# Altium schematic sheet PFC_Stage.SchDoc
size A2; Author: Rahul G; DrawnBy: Rahul G; Engineer: Rahul G; DocumentNumber: 1; SheetNumber: 1; SheetTotal: 10
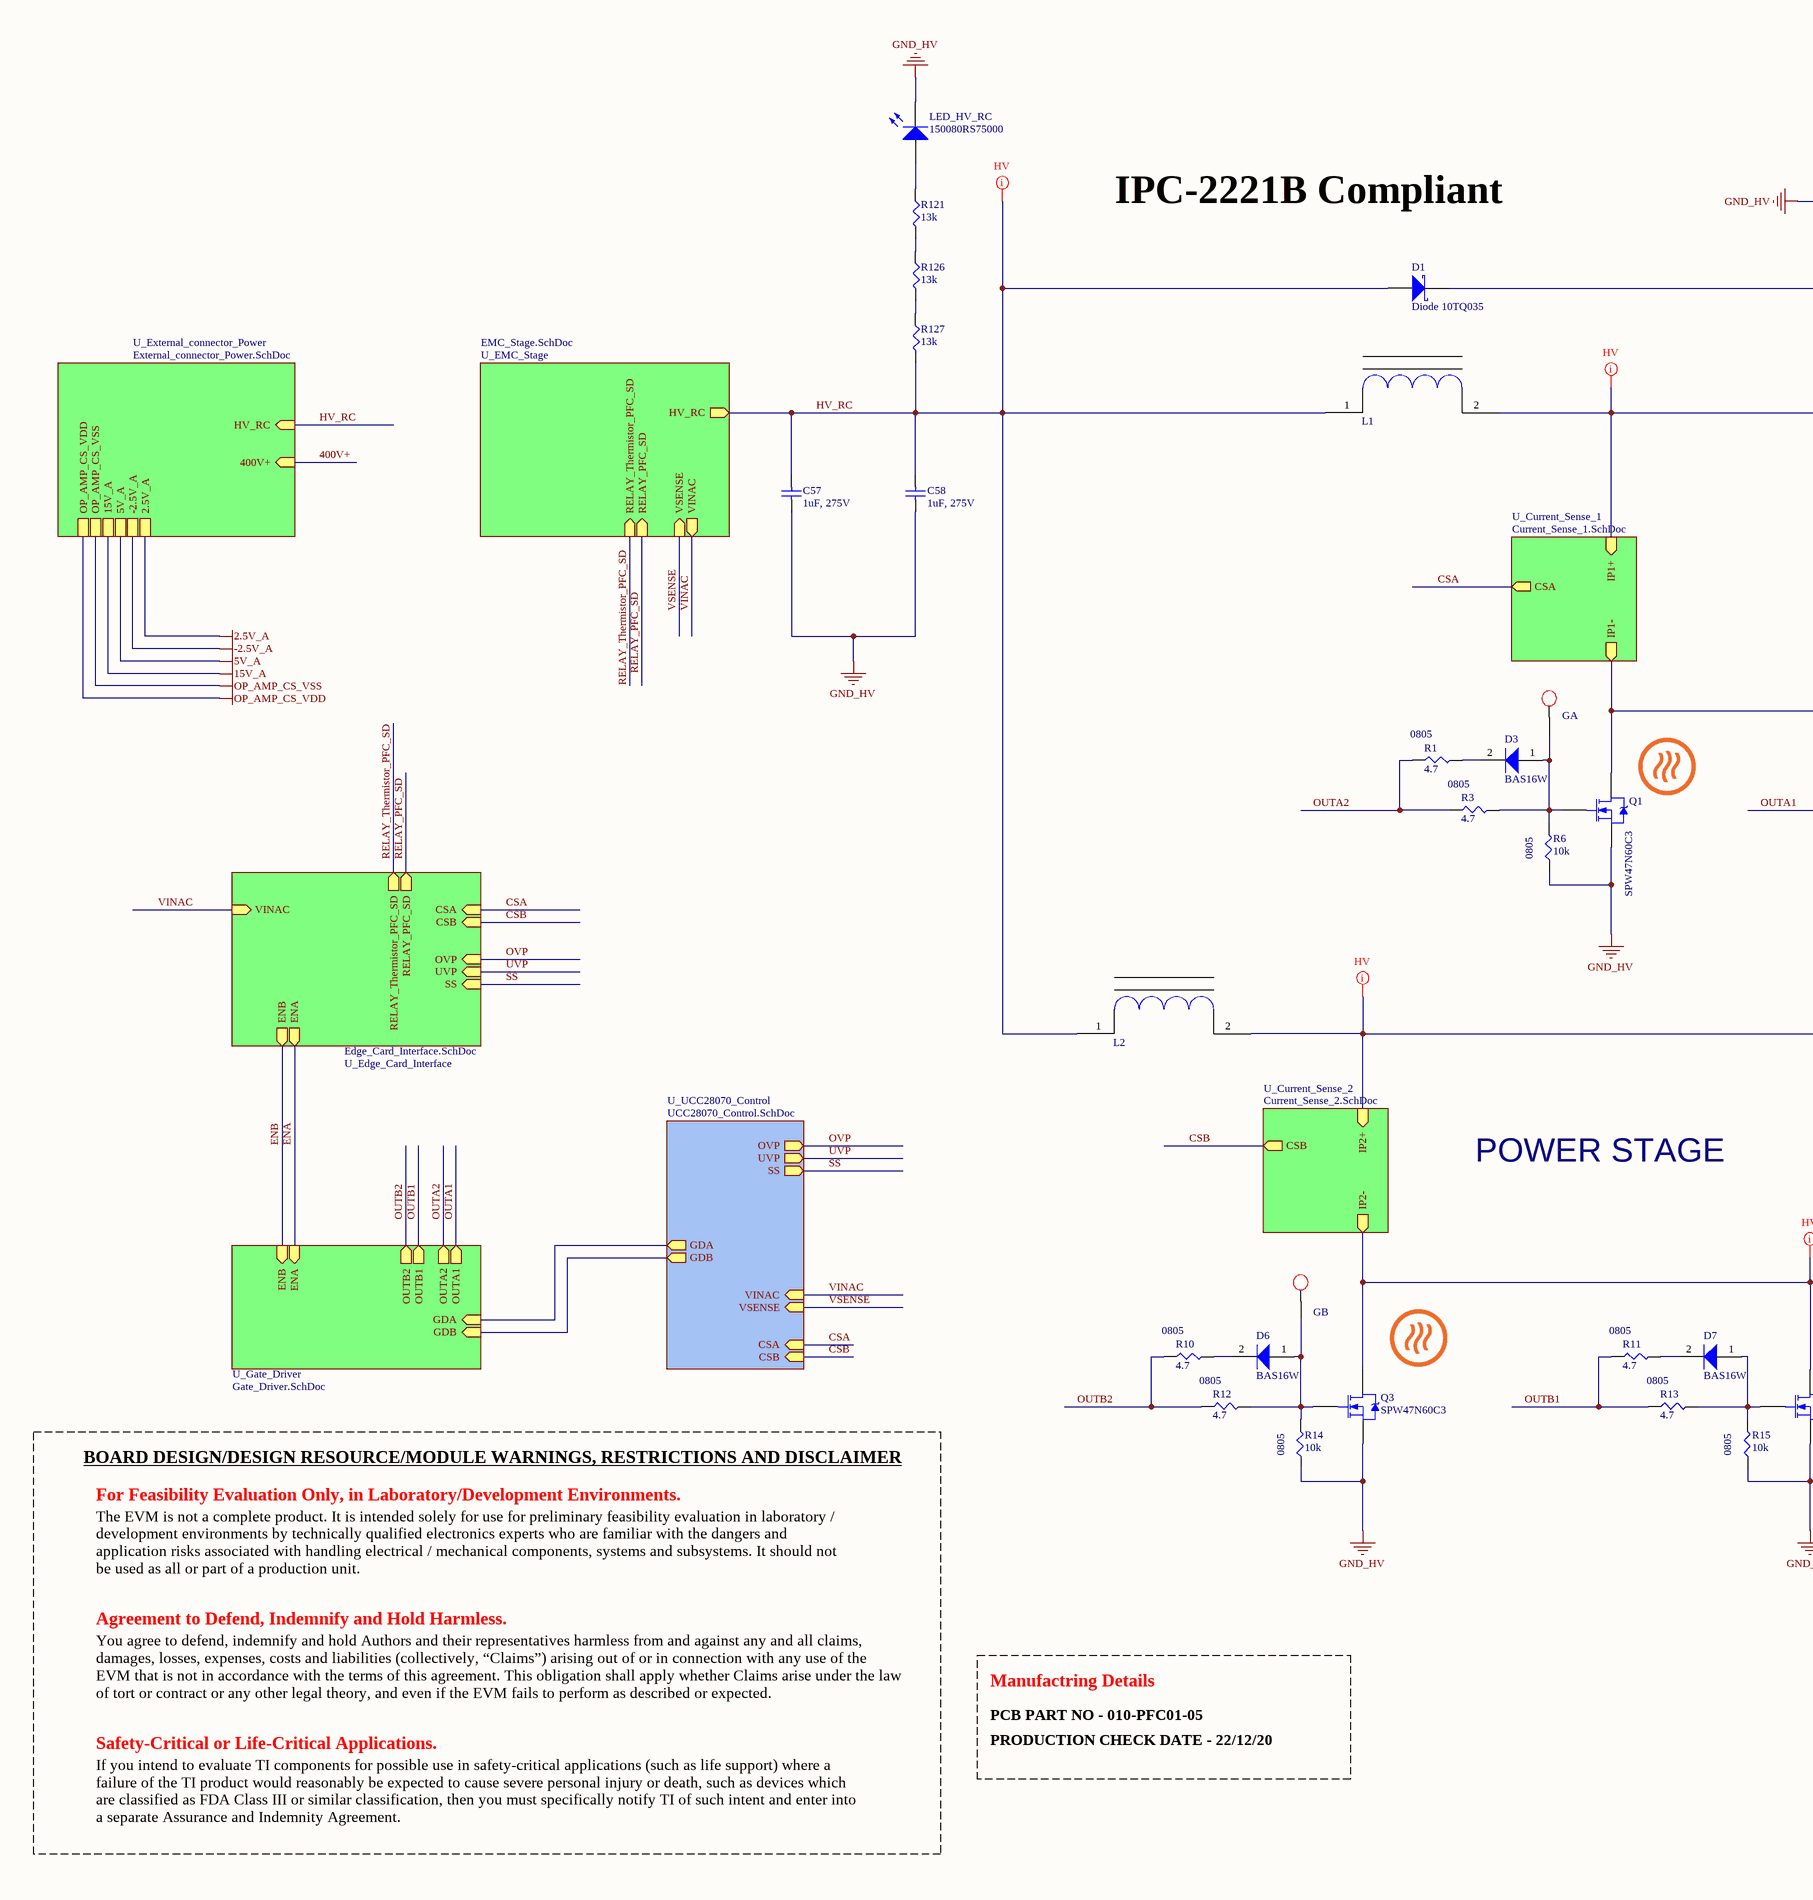
[diagram p0: PFC_Stage.SchDoc, left]
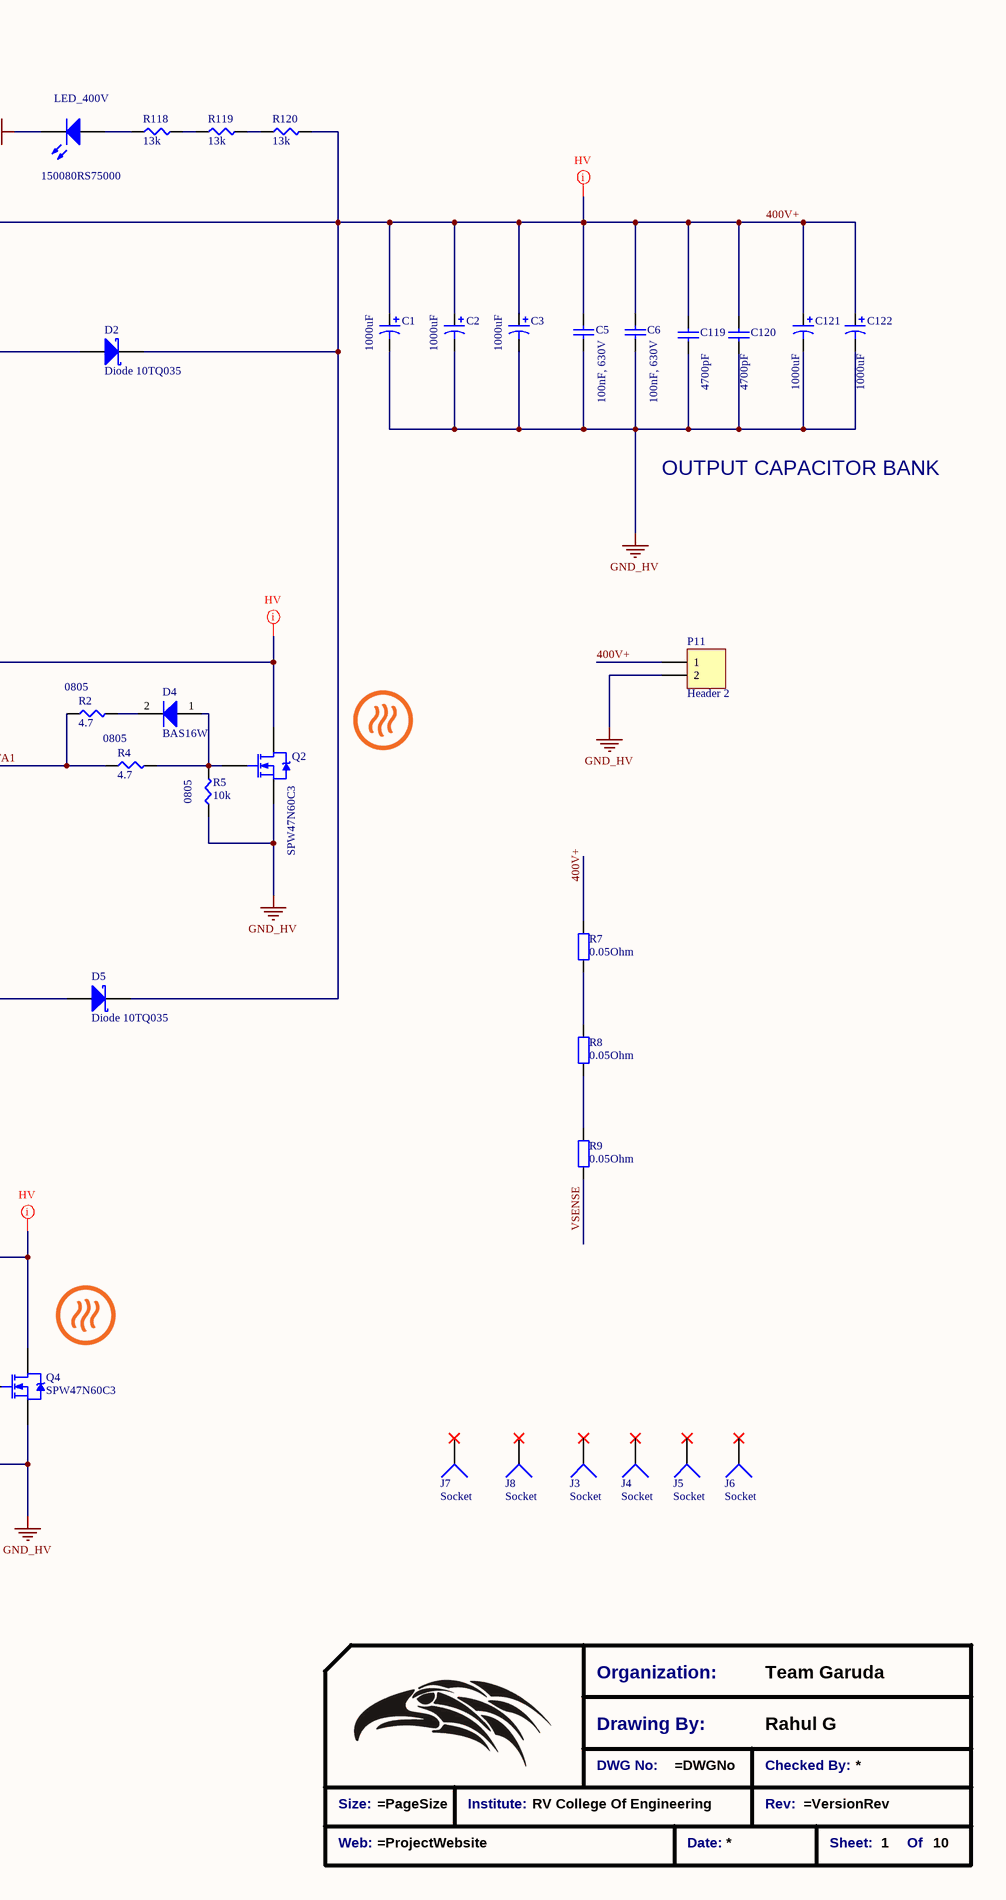
[diagram p1: PFC_Stage.SchDoc, right]

## Parts
*  Title_Block  (value not drawn)  (graphical)
C1  value 1000uF  [450V_40mm_10mm]  (hidden comment: 40mm)
C2  value 1000uF  [450V_40mm_10mm]  (hidden comment: 40mm)
C3  value 1000uF  [450V_40mm_10mm]  (hidden comment: 40mm)
C5  100nF, 630V  [L18_W6_H12_P15]
C6  100nF, 630V  [L18_W6_H12_P15]
C57  1uF, 275V  [L26_W11_H20_P22.5_CS]
C58  1uF, 275V  [L26_W11_H20_P22.5_CS]
C119  value 4700pF  [VY1472M61Y5UC63V0]  (hidden comment: VY1472M61Y5UC63V0)
C120  value 4700pF  [VY1472M61Y5UC63V0]  (hidden comment: VY1472M61Y5UC63V0)
C121  value 1000uF  [450V_40mm_10mm]  (hidden comment: 40mm)
C122  value 1000uF  [450V_40mm_10mm]  (hidden comment: 40mm)
D1  Diode 10TQ035  [INF-PG-TO247-2-MOD]
D2  Diode 10TQ035  [INF-PG-TO247-2-MOD]
D3  BAS16W  [SODFL250X110-2N]
D4  BAS16W  [SODFL250X110-2N]
D5  Diode 10TQ035  [INF-PG-TO247-2-MOD]
D6  BAS16W  [SODFL250X110-2N]
D7  BAS16W  [SODFL250X110-2N]
GA  Test Point  [Test_point_SMD]  (value not drawn)  (no BOM)
GB  Test Point  [Test_point_SMD]  (value not drawn)  (no BOM)
J3  Socket  [Mounting_hole_3mm]
J4  Socket  [Mounting_hole_3mm]
J5  Socket  [Mounting_hole_3mm]
J6  Socket  [Mounting_hole_3mm]
J7  Socket  [Mounting_hole_3mm_no_body]
J8  Socket  [Mounting_hole_3mm_no_body]
L1  Transformer_Inductor  [PFC_Toroid_MPP]  (value not drawn)
L2  Transformer_Inductor  [PFC_Toroid_MPP]  (value not drawn)
LED_400V  150080RS75000  [0805_A]
LED_HV_RC  150080RS75000  [0805_A]
P11  Header 2  [Barrier_Strip_2]
Q1  SPW47N60C3  [INF-PG-TO247-3-44]
Q2  SPW47N60C3  [INF-PG-TO247-3-44]
Q3  SPW47N60C3  [INF-PG-TO247-3-44]
Q4  SPW47N60C3  [INF-PG-TO247-3-44]
R1  4.7  Supplier Device Package: 0805  [SMD-0805-RES]
R2  4.7  Supplier Device Package: 0805  [SMD-0805-RES]
R3  4.7  Supplier Device Package: 0805  [SMD-0805-RES]
R4  4.7  Supplier Device Package: 0805  [SMD-0805-RES]
R5  10k  Supplier Device Package: 0805  [SMD-0805-RES]
R6  10k  Supplier Device Package: 0805  [SMD-0805-RES]
R7  0.05Ohm  [WRIS-KSKE_1206_H=0.6mm]
R8  0.05Ohm  [WRIS-KSKE_1206_H=0.6mm]
R9  0.05Ohm  [WRIS-KSKE_1206_H=0.6mm]
R10  4.7  Supplier Device Package: 0805  [SMD-0805-RES]
R11  4.7  Supplier Device Package: 0805  [SMD-0805-RES]
R12  4.7  Supplier Device Package: 0805  [SMD-0805-RES]
R13  4.7  Supplier Device Package: 0805  [SMD-0805-RES]
R14  10k  Supplier Device Package: 0805  [SMD-0805-RES]
R15  10k  Supplier Device Package: 0805  [SMD-0805-RES]
R118  13k  [SMD-2512-RES]
R119  13k  [SMD-2512-RES]
R120  13k  [SMD-2512-RES]
R121  13k  [SMD-2512-RES]
R126  13k  [SMD-2512-RES]
R127  13k  [SMD-2512-RES]

## Sub-sheets
U_Current_Sense_1 = Current_Sense_1.SchDoc: CSA (out), IP1+ (in), IP1- (out)
U_Current_Sense_2 = Current_Sense_2.SchDoc: CSB (out), IP2+ (in), IP2- (out)
U_Edge_Card_Interface = Edge_Card_Interface.SchDoc: OVP (in), UVP (in), CSA (in), CSB (in), SS (in), RELAY_PFC_SD (out), RELAY_Thermistor_PFC_SD (out), ENB (out), ENA (out), VINAC (in)
U_EMC_Stage = EMC_Stage.SchDoc: RELAY_PFC_SD (in), HV_RC (out), VINAC (out), VSENSE (in), RELAY_Thermistor_PFC_SD (in)
U_External_connector_Power = External_connector_Power.SchDoc: 400V+ (in), OP_AMP_CS_VDD, -2.5V_A, 15V_A, OP_AMP_CS_VSS, 5V_A, 2.5V_A, HV_RC (in)
U_Gate_Driver = Gate_Driver.SchDoc: GDB (in), GDA (in), ENB (in), ENA (in), OUTA2 (out), OUTB2 (out), OUTB1 (out), OUTA1 (out)
U_UCC28070_Control = UCC28070_Control.SchDoc: GDB (out), CSA (in), CSB (in), VINAC (in), GDA (out), VSENSE (in), OVP (out), UVP (out), SS (out)

## Nets
2.5V_A: sheet U_External_connector_Power/2.5V_A
5V_A: sheet U_External_connector_Power/5V_A
15V_A: sheet U_External_connector_Power/15V_A
-2.5V_A: sheet U_External_connector_Power/-2.5V_A
GND_HV: C1.2 C2.2 C3.2 C5.1 C6.1 C57.1 C58.1 C119.1 C120.1 C121.2 C122.2 LED_400V.1(K) LED_HV_RC.1(K) P11.2 Q1.3(S) Q2.3(S) Q3.3(S) Q4.3(S) R5.1 R6.1 R14.1 R15.1
OP_AMP_CS_VDD: sheet U_External_connector_Power/OP_AMP_CS_VDD
OP_AMP_CS_VSS: sheet U_External_connector_Power/OP_AMP_CS_VSS
400V+: C1.1 C2.1 C3.1 C5.2 C6.2 C119.2 C120.2 C121.1 C122.1 D1.1(K) D2.1(K) D5.1(K) P11.1 R7.2 R120.2 ; sheet U_External_connector_Power/400V+
CSA: sheet U_UCC28070_Control/CSA, sheet U_Current_Sense_1/CSA, sheet U_Edge_Card_Interface/CSA
CSB: sheet U_UCC28070_Control/CSB, sheet U_Current_Sense_2/CSB, sheet U_Edge_Card_Interface/CSB
ENA: sheet U_Gate_Driver/ENA, sheet U_Edge_Card_Interface/ENA
ENB: sheet U_Gate_Driver/ENB, sheet U_Edge_Card_Interface/ENB
HV_RC: C57.2 C58.2 D1.3(A) L1.1 L2.1 R127.2 ; sheet U_EMC_Stage/HV_RC, sheet U_External_connector_Power/HV_RC
OUTA1: R2.1 R4.1 ; sheet U_Gate_Driver/OUTA1
OUTA2: R1.1 R3.1 ; sheet U_Gate_Driver/OUTA2
OUTB1: R11.1 R13.1 ; sheet U_Gate_Driver/OUTB1
OUTB2: R10.1 R12.1 ; sheet U_Gate_Driver/OUTB2
OVP: sheet U_UCC28070_Control/OVP, sheet U_Edge_Card_Interface/OVP
RELAY_PFC_SD: sheet U_EMC_Stage/RELAY_PFC_SD, sheet U_Edge_Card_Interface/RELAY_PFC_SD
RELAY_Thermistor_PFC_SD: sheet U_EMC_Stage/RELAY_Thermistor_PFC_SD, sheet U_Edge_Card_Interface/RELAY_Thermistor_PFC_SD
SS: sheet U_UCC28070_Control/SS, sheet U_Edge_Card_Interface/SS
UVP: sheet U_UCC28070_Control/UVP, sheet U_Edge_Card_Interface/UVP
VINAC: sheet U_UCC28070_Control/VINAC, sheet U_EMC_Stage/VINAC, sheet U_Edge_Card_Interface/VINAC
VSENSE: R9.1 ; sheet U_UCC28070_Control/VSENSE, sheet U_EMC_Stage/VSENSE
NetD2_3: D2.3(A) L1.2 ; sheet U_Current_Sense_1/IP1+
NetD3_1: D3.1(A) GA.1 Q1.1(G) R3.2 R6.2
NetD3_2: D3.2(K) R1.2
NetD4_1: D4.1(A) Q2.1(G) R4.2 R5.2
NetD4_2: D4.2(K) R2.2
NetD5_3: D5.3(A) L2.2 ; sheet U_Current_Sense_2/IP2+
NetD6_1: D6.1(A) GB.1 Q3.1(G) R12.2 R14.2
NetD6_2: D6.2(K) R10.2
NetD7_1: D7.1(A) Q4.1(G) R13.2 R15.2
NetD7_2: D7.2(K) R11.2
NetLED_400V_2: LED_400V.2(A) R118.1
NetLED_HV_RC_2: LED_HV_RC.2(A) R121.1
NetQ1_2: Q1.2(D) Q2.2(D) ; sheet U_Current_Sense_1/IP1-
NetQ3_2: Q3.2(D) Q4.2(D) ; sheet U_Current_Sense_2/IP2-
NetR7_1: R7.1 R8.2
NetR8_1: R8.1 R9.2
NetR118_2: R118.2 R119.1
NetR119_2: R119.2 R120.1
NetR121_2: R121.2 R126.1
NetR126_2: R126.2 R127.1
(unnamed): sheet U_UCC28070_Control/GDB, sheet U_Gate_Driver/GDB
(unnamed): sheet U_UCC28070_Control/GDA, sheet U_Gate_Driver/GDA

Not connected (* = marked no-connect by the designer): J3 1*; J4 1*; J5 1*; J6 1*; J7 1*; J8 1*

## Layout directives
net class HV; rule Clearance Constraint [Generic clearance = 50mil, and 18 value(s) for objects]: 400V+, HV_RC, NetD2_3, NetD5_3, NetQ1_2, NetQ3_2

## Notes on the sheet
- IPC-2221B Compliant
- OUTPUT CAPACITOR BANK
- POWER STAGE
- BOARD DESIGN/DESIGN RESOURCE/MODULE WARNINGS, RESTRICTIONS AND DISCLAIMER
- For Feasibility Evaluation Only, in Laboratory/Development Environments.
- The EVM is not a complete product. It is intended solely for use for preliminary feasibility evaluation in laboratory / development environments by technically qualified electronics experts who are familiar with the dangers and application risks associated with handling electrical / mechanical components, systems and subsystems. It should not be used as all or part of a production unit.
- Agreement to Defend, Indemnify and Hold Harmless.
- You agree to defend, indemnify and hold Authors and their representatives harmless from and against any and all claims, damages, losses, expenses, costs and liabilities (collectively, “Claims”) arising out of or in connection with any use of the
  EVM that is not in accordance with the terms of this agreement. This obligation shall apply whether Claims arise under the law of tort or contract or any other legal theory, and even if the EVM fails to perform as described or expected.
- Manufactring Details
- PCB PART NO - 010-PFC01-05
- Safety-Critical or Life-Critical Applications.
- PRODUCTION CHECK DATE - 22/12/20
- If you intend to evaluate TI components for possible use in safety-critical applications (such as life support) where a failure of the TI product would reasonably be expected to cause severe personal injury or death, such as devices which are classified as FDA Class III or similar classification, then you must specifically notify TI of such intent and enter into a separate Assurance and Indemnity Agreement.
- (in symbol Title_Block) Organization:; Team Garuda; Drawing By:; DWG No:; Checked By:; Size:; Institute:; RV College Of Engineering; Rev:; Web:; Date:; Sheet:; Of

## Library data of the parts
* = Title_Block: Standard Title Block
C1-C3 C121 C122 = Cap Pol1: Polarized Capacitor (Radial); Published: 8-Jun-2000; LatestRevisionDate: 17-Jul-2002; LatestRevisionNote: Re-released for DXP Platform.; PackageReference: RB7.6-15; Publisher: Altium Limited; PackageDescription: Polarized Capacitor (Radial); 2 Leads
C5 C6 = 890303425004CS: WCAP-FTBE THT Film Capacitors, 100nF, 630VDC; Insulation Resistance: 9000MOhm; Dissipation Factor@100kHz: 3.2%; Dissipation Factor@1kHz: 1%; Dissipation Factor@10kHz: 1.4%; Pitch: 15mm; Rate of Voltage Rise: 28V/us; Technical Reference: MPSP015104K630DCPP45004; ComponentLink1Description: Manufacturer; ComponentLink1URL: http://www.we-online.de; ComponentLink2Description: Datasheet; ComponentLink2URL: https://katalog.we-online.com/pbs/datasheet/890303425004CS.pdf; Length: 18mm; Mounting Technology: THT; Packaging: Carton; Part Number: 890303425004CS; Operating Temperature: -40 to +85degC; Width: 6mm; Capacitance: 100nF; Height: 12mm; Rated Voltage: 630VDC; Publisher: Wurth Elektronik; Published Date: August 2019
C57 C58 = 890324026027CS: WCAP-FTX2 THT Film Capacitors, 1uF, 275VAC; Insulation Resistance: 10000Ohm x F; Dissipation Factor@1kHz: 0.1%; Dissipation Factor@10kHz: 0.7%; Pitch: 22.5mm; Rate of Voltage Rise: 170V/us; Technical Reference: MX2P225105K275ACPP36004; ComponentLink1Description: Manufacturer; ComponentLink1URL: http://www.we-online.de; ComponentLink2Description: Datasheet; ComponentLink2URL: https://katalog.we-online.com/pbs/datasheet/890324026027CS.pdf; Length: 26mm; Mounting Technology: THT; Packaging: Bulk and Carton; Part Number: 890324026027CS; Operating Temperature: -40 to +105degC; Width: 11mm; Capacitance: 1uF; Dissipation Factor@100kHz: -; Height: 20mm; Rated Voltage: 275VAC; Publisher: Wurth Elektronik; Published Date: August 2019
C119 C120 = VY1472M61Y5UC63V0: Capacitor; Published: 8-Jun-2000; LatestRevisionDate: 17-Jul-2002; LatestRevisionNote: Re-released for DXP Platform.; PackageReference: RAD-0.3; Publisher: Altium Limited; PackageDescription: Radial Cap, Thru-Hole; 2 Leads; 0.3 in Pin Spacing
D1 D2 D5 = Diode 10TQ035: Schottky Rectifier; Note: Terminal 2 is the TAB and is electrically connected to the cathode; Published: 8-Jun-2000; LatestRevisionDate: 17-Jul-2002; LatestRevisionNote: Re-released for DXP Platform.; DatasheetVersion: PD-2.057B; PackageVersion: Feb-1998; PackageReference: TO-220AC; Publisher: Altium Limited; PackageDescription: TO, Thru-Hole, Vertical, Heatsink Mounted; 3 In-Line Leads (1 Absent); Pitch 2.54 mm; ComponentLink1Description: Manufacturer Link; ComponentLink1URL: http://www.irf.com/; ComponentLink2Description: Datasheet; ComponentLink2URL: http://www.irf.com/product-info/datasheets/data/10tq.pdf
D3 D4 D6 D7 = BAS16_SOD: Silicon Switching Diode, SOT323, Reel, Green; Manufacturer: Infineon; IR (max): 100Â nA; Configuration: Single; VBR (min): 85Â V; VR (max): 80Â V; trr (max): 4Â ns; Green: TRUE; VF (max): 1.25Â V; IF (max): 250Â mA; Mounting Technology: Surface Mount; PackageReference: SOT323; ComponentLink2URL: http://www.infineon.com/dgdl/bas16series.pdf?folderId=db3a30431400ef6801141b5844e103ea&fileId=db3a30431400ef6801141b93811b03ff; Halogen-free: TRUE; ComponentLink2Description: Datasheet; PartNumber: BAS16W; ComponentLink1Description: Manufacturer URL; ComponentLink3URL: http://www.infineon.com/dgdl/SOT323-Package_Overview.pdf?folderId=db3a30431936bc4b0119533e1dcb3c92&fileId=db3a30431936bc4b011953495f283cb1; ComponentLink1URL: http://www.infineon.com/; PackageDescription: 3-Pin Small Outline Transistor Package, 1.25 x 2 mm Body, 0.65 mm Pitch; ComponentLink3Description: Package Specification
GA GB = Test Point: TP
LED_400V LED_HV_RC = 150080RS75000: SMD mono-color Chip LED, WL-SMCW, Red; PackageReference: 0805_A; Color: Red; PartNumber: 150080RS75000; ComponentLink1Description: Manufacturer URL; ComponentLink1URL: http://www.we-online.com; ComponentLink2Description: Datasheet; ComponentLink2URL: http://katalog.we-online.com/led/datasheet/150080RS75000.pdf
P11 = Header 2: Header, 2-Pin; LatestRevisionDate: 17-Jul-2002; LatestRevisionNote: Re-released for DXP Platform.; Publisher: Altium Limited
Q1-Q4 = NMOS-2: N-Channel Power MOSFET; Note: Pin 2 is electrically connected to pin 4.; Published: 8-Jun-2000; LatestRevisionDate: 17-Jul-2002; LatestRevisionNote: Re-released for DXP Platform.; DatasheetVersion: PD-9.814; PackageVersion: Feb-1997; PackageReference: TO-220AB; Publisher: Altium Limited; PackageDescription: TO, Thru-Hole, Vertical, Heatsink Mounted; 3 In-Line Leads; Pitch 2.54 mm; ComponentLink1Description: Manufacturer Link; ComponentLink1URL: http://www.irf.com/
R1-R4 R10-R13 = ERJ-6BQF4R7V: RES SMD 4.7 OHM 1% 1/3W 0805; Manufacturer: Panasonic Electronic Components; Factory Stock: 0; Unit Price (USD): 0.07013; @ qty: 1500; Minimum Quantity: 1; Power (Watts): 0.333W, 1/3W; Temperature Coefficient: ±200ppm/°C; Part Number: ERJ-6BQF4R7V; Datasheets: https://industrial.panasonic.com/cdbs/www-data/pdf/RDA0000/AOA0000C239.pdf; Image: //media.digikey.com/Renders/Panasonic%20Renders/ERJ-0805%20Pkg.jpg; Digi-Key Part Number: P15995CT-ND; Quantity Available: 9150; Packaging: Cut Tape (CT); Series: ERJ; Part Status: Active; Value: 4.7; Tolerance: ±1%; Composition: Thick Film; Features: Automotive AEC-Q200, Current Sense; Operating Temperature: -55°C ~ 125°C; Package / Case: 0805 (2012 Metric); Size / Dimension: 0.079" L x 0.049" W (2.00mm x 1.25mm); Height - Seated (Max): 0.028" (0.70mm); Number of Terminations: 2; Failure Rate: -
R5 R6 R14 R15 = ERJ-6ENF1002V: RES SMD 10K OHM 1% 1/8W 0805; Manufacturer: Panasonic Electronic Components; Factory Stock: 0; Unit Price (USD): 0.00729; @ qty: 1500; Minimum Quantity: 1; Power (Watts): 0.125W, 1/8W; Temperature Coefficient: ±100ppm/°C; Part Number: ERJ-6ENF1002V; Datasheets: http://industrial.panasonic.com/www-cgi/jvcr13pz.cgi?E+PZ+3+AOA0002+ERJ6ENF1002V+7+WW; Image: //media.digikey.com/Renders/Panasonic%20Renders/ERJ-0805%20Pkg.jpg; Digi-Key Part Number: P10.0KCCT-ND; Quantity Available: 3985614; Packaging: Cut Tape (CT); Series: ERJ; Part Status: Active; Value: 10k; Tolerance: ±1%; Composition: Thick Film; Features: Automotive AEC-Q200; Operating Temperature: -55°C ~ 155°C; Package / Case: 0805 (2012 Metric); Size / Dimension: 0.079" L x 0.049" W (2.00mm x 1.25mm); Height - Seated (Max): 0.028" (0.70mm); Number of Terminations: 2; Failure Rate: -
R7-R9 = 560050332001: WRIS-KSKE Thick Film Resistors, size 1206, 0.05Ohm, +/-1%, 0.5W; Rated Current: 3.16A; Temperature Coefficient of Resistance: 250ppm/degC; Technical Reference: KE1206R050F102LAATP0000; ComponentLink1Description: Manufacturer; ComponentLink1URL: http://www.we-online.de; ComponentLink2Description: Datasheet; ComponentLink2URL: https://katalog.we-online.com/pbs/datasheet/560050332001.pdf; Publisher: Wurth Elektronik; Rated Power: 0.5W; Resistance: 0.05Ohm; Mounting Technology: SMT; Height: 0.6mm; Part Number: 560050332001; Packaging: Tape and Reel; Published Date: September 2019; Size: 1206; Length: 3.1mm; Operating Temperature: -55 to +155degC; Resistance Tolerance: +/-1%; Width: 1.6mm
R118-R121 R126 R127 = ERJ-1TNF1302U: RES SMD 13K OHM 1% 1W 2512; Manufacturer: Panasonic Electronic Components; Factory Stock: 0; Unit Price (USD): 0.14799; @ qty: 1500; Minimum Quantity: 1; Temperature Coefficient: ±100ppm/°C; Part Number: ERJ-1TNF1302U; Datasheets: http://industrial.panasonic.com/www-cgi/jvcr13pz.cgi?E+PZ+3+AOA0002+ERJ1TNF1302U+7+WW; Image: //media.digikey.com/Renders/Panasonic%20Renders/ERJ-2512%20Pkg.jpg; Digi-Key Part Number: PT13.0KAFCT-ND; Quantity Available: 2142; Packaging: Cut Tape (CT); Series: ERJ; Part Status: Active; Value: 13k; Tolerance: ±1%; Power (Watts): 1W; Composition: Thick Film; Features: Automotive AEC-Q200; Operating Temperature: -55°C ~ 155°C; Package / Case: 2512 (6432 Metric); Supplier Device Package: 2512; Size / Dimension: 0.252" L x 0.126" W (6.40mm x 3.20mm); Height - Seated (Max): 0.028" (0.70mm); Number of Terminations: 2; Failure Rate: -
J3-J8 = Socket: LatestRevisionDate: 17-Jul-2002; LatestRevisionNote: Re-released for DXP Platform.; Publisher: Altium Limited